# EAGLE design Sunflower (EAGLE 7.7.0)
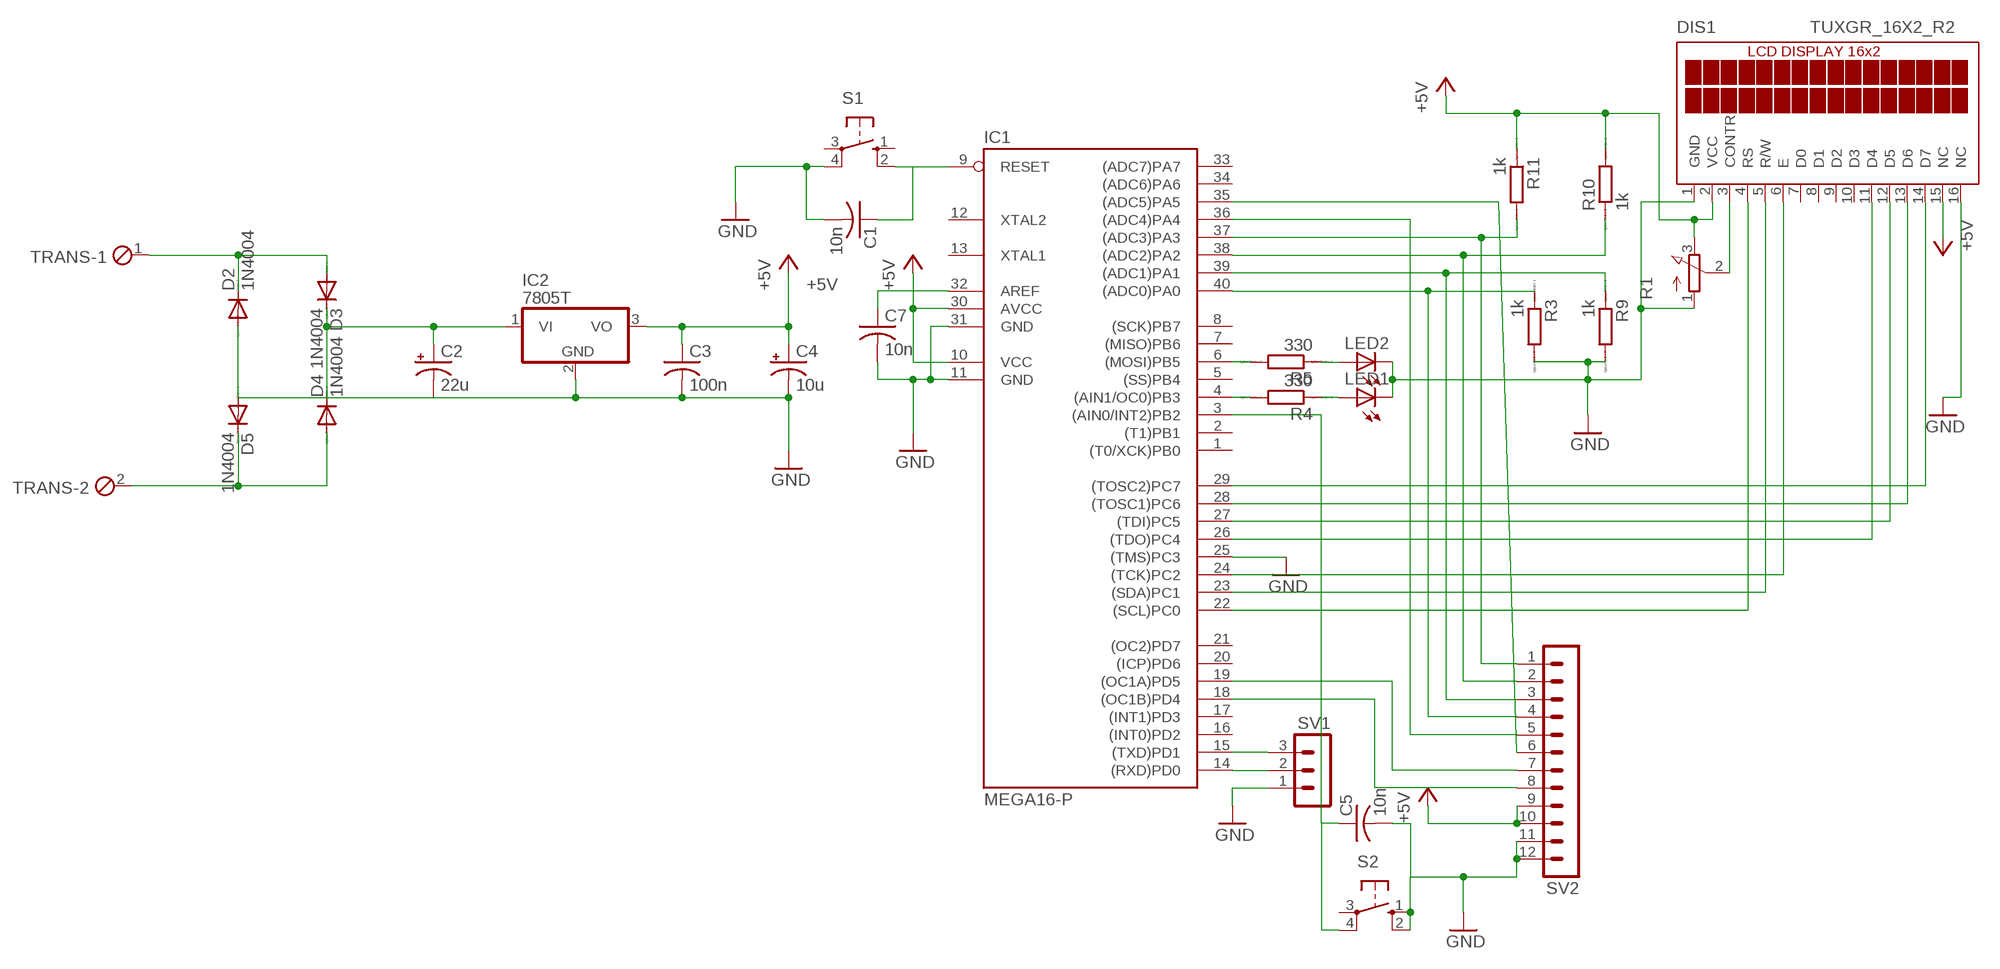
[diagram p0: schematic, sheet 1]

## Parts
C1  10n  C-US025-024X044  [C025-024X044]
C2  22u  CPOL-USE2.5-6  [E2,5-6]
C3  100n  C-US025-024X044  [C025-024X044]
C4  10u  CPOL-USE2.5-6  [E2,5-6]
C5  10n  C-US025-024X044  [C025-024X044]
C7  10n  C-US050-024X044  [C050-024X044]
D2  1N4004  [DO41-10]
D3  1N4004  [DO41-10]
D4  1N4004  [DO41-10]
D5  1N4004  [DO41-10]
DIS1  TUXGR_16X2_R2  [TUXGR_16X2_R2]
IC1  MEGA16-P  [DIL40]
IC2  7805T  [TO220H]
LED1  LED3MM  [LED3MM]
LED2  LED3MM  [LED3MM]
R1  3RP/1610N  [3RP/1610N]
R3  1k  R0207/10  [0207/10]
R4  330  R0207/10  [0207/10]
R5  330  R0207/10  [0207/10]
R9  1k  R0207/10  [0207/10]
R10  1k  R0207/10  [0207/10]
R11  1k  R0207/10  [0207/10]
S1  10-XX  [B3F-10XX]
S2  10-XX  [B3F-10XX]
SV1  MA03-1  [MA03-1]
SV2  MA12-1  [MA12-1]
TRANS  MPT2  [2POL254]

## Nets
+5V: C3.1 C4.+ DIS1.2(VCC) DIS1.15(NC) IC1.10(VCC) IC1.30(AVCC) IC2.3(VO) R1.3(E) R10.2 R11.1 SV2.9 SV2.10
GND: C1.2 C2.- C3.2 C4.- C5.2 C7.2 D2.A D5.A DIS1.1(GND) DIS1.16(NC) IC1.11(GND) IC1.25((TMS)PC3) IC1.31(GND) IC2.2(GND) LED1.K(C) LED2.K(C) R1.1(A) R3.2 R9.2 S1.4(P1) S2.1(S) S2.2(S1) SV1.1 SV2.11 SV2.12
N$1: D2.C D3.A TRANS.1
N$2: IC1.6((MOSI)PB5) R5.2
N$3: IC1.4((AIN1/OC0)PB3) R4.2
N$4: C2.+ D3.C D4.C IC2.1(VI)
N$5: C7.1 IC1.32(AREF)
N$6: LED2.A R5.1
N$7: DIS1.4(RS) IC1.22((SCL)PC0)
N$8: DIS1.5(R/W) IC1.23((SDA)PC1)
N$9: DIS1.6(E) IC1.24((TCK)PC2)
N$10: DIS1.14(D7) IC1.29((TOSC2)PC7)
N$11: DIS1.13(D6) IC1.28((TOSC1)PC6)
N$12: DIS1.12(D5) IC1.27((TDI)PC5)
N$13: DIS1.11(D4) IC1.26((TDO)PC4)
N$14: C5.1 IC1.3((AIN0/INT2)PB2) S2.4(P1)
N$15: IC1.40((ADC0)PA0) R3.1 SV2.4
N$16: IC1.18((OC1B)PD4) SV2.8
N$17: IC1.19((OC1A)PD5) SV2.7
N$18: DIS1.3(CONTR) R1.2(S)
N$19: IC1.37((ADC3)PA3) R11.2 SV2.1
N$20: IC1.39((ADC1)PA1) R9.1 SV2.3
N$21: IC1.38((ADC2)PA2) R10.1 SV2.2
N$22: LED1.A R4.1
N$23: IC1.36((ADC4)PA4) SV2.5
N$24: C1.1 IC1.9(RESET) S1.2(S1)
N$25: IC1.35((ADC5)PA5) SV2.6
N$26: IC1.15((TXD)PD1) SV1.3
N$27: IC1.14((RXD)PD0) SV1.2
O: D4.A D5.C TRANS.2
Unconnected: DIS1.7(D0) DIS1.8(D1) DIS1.9(D2) DIS1.10(D3) IC1.1((T0/XCK)PB0) IC1.2((T1)PB1) IC1.5((SS)PB4) IC1.7((MISO)PB6) IC1.8((SCK)PB7) IC1.12(XTAL2) IC1.13(XTAL1) IC1.16((INT0)PD2) IC1.17((INT1)PD3) IC1.20((ICP)PD6) IC1.21((OC2)PD7) IC1.33((ADC7)PA7) IC1.34((ADC6)PA6) S1.1(S) S1.3(P) S2.3(P)

## Library data of the parts
C1 C3 C5 C7 = rcl:C-US: CAPACITOR, American symbol
C2 C4 = rcl:CPOL-US: POLARIZED CAPACITOR, American symbol
D2-D5 = diode:1N4004: DIODE general purpose rectifier, 1 A
DIS1 = display-lcd:TUXGR_16X2_R2: Tuxgraphics LCD display 16x2 characters reflective, without background light Source: tuxgr_12x2_r2.pdf; OC_FARNELL: unknown; OC_NEWARK: unknown
IC1 = atmel:MEGA16-P: MICROCONTROLLER 16 Kbytes FLASH 1 kbytes SRAM 512 bytes EEPROM USART 8-channel 10 bit ADC Source: avr.lbr; MPN: ATMEGA16-16PU; OC_FARNELL: 9171142; OC_NEWARK: 01M6885
IC2 = linear:78*: Positive VOLTAGE REGULATOR Source: http://cache.national.com/ds/LM/LM78L05.pdf http://www.fairchildsemi.com/ds/LM/LM7805.pdf
LED1 LED2 = led:LED: LED OSRAM: - CHIPLED LG R971, LG N971, LY N971, LG Q971, LY Q971, LO R971, LY R971 LH N974, LH R974 LS Q976, LO Q976, LY Q976 LO Q996 - Hyper CHIPLED LW Q18S LB Q993, LB Q99A, LB R99A - SideLED LS A670, LO A670, LY A670, LG A670, LP A670 LB A673, LV A673, LT A673, LW A673 LH A674 LY A675 LS A676, LA A676, LO A676, LY A676, LW A676 LS A679, LY A679, LG A679 - Hyper Micro SIDELED® LS Y876, LA Y876, LO Y876, LY Y876 LT Y87S - SmartLED LW L88C, LW L88S LB L89C, LB L89S, LG L890 LS L89K, LO L89K, LY L89K LS L896, LA L896, LO L896, LY L896 - TOPLED LS T670, LO T670, LY T670, LG T670, LP T670 LSG T670, LSP T670, LSY T670, LOP T670, LYG T670 LG T671, LOG T671, LSG T671 LB T673, LV T673, LT T673, LW T673 LH T674 LS T676, LA T676, LO T676, LY T676, LB T676, LH T676, LSB T676, LW T676 LB T67C, LV T67C, LT T67C, LS T67K, LO T67K, LY T67K, LW E67C LS E67B, LA E67B, LO E67B, LY E67B, LB E67C, LV E67C, LT E67C LW T67C LS T679, LY T679, LG T679 LS T770, LO T770, LY T770, LG T770, LP T770 LB T773, LV T773, LT T773, LW T773 LH T774 LS E675, LA E675, LY E675, LS T675 LS T776, LA T776, LO T776, LY T776, LB T776 LHGB T686 LT T68C, LB T68C - Hyper Mini TOPLED® LB M676 - Mini TOPLED Santana® LG M470 LS M47K, LO M47K, LY M47K Source: http://www.osram.convergy.de LUXEON: - LUMILED® LXK2-PW12-R00, LXK2-PW12-S00, LXK2-PW14-U00, LXK2-PW14-V00 LXK2-PM12-R00, LXK2-PM12-S00, LXK2-PM14-U00 LXK2-PE12-Q00, LXK2-PE12-R00, LXK2-PE12-S00, LXK2-PE14-T00, LXK2-PE14-U00 LXK2-PB12-K00, LXK2-PB12-L00, LXK2-PB12-M00, LXK2-PB14-N00, LXK2-PB14-P00, LXK2-PB14-Q00 LXK2-PR12-L00, LXK2-PR12-M00, LXK2-PR14-Q00, LXK2-PR14-R00 LXK2-PD12-Q00, LXK2-PD12-R00, LXK2-PD12-S00 LXK2-PH12-R00, LXK2-PH12-S00 LXK2-PL12-P00, LXK2-PL12-Q00, LXK2-PL12-R00 Source: www.luxeon.com KINGBRIGHT: KA-3528ASYC Source: www.kingbright.com
R1 = pot:3RP/1610N: 16mm Potentiometer one level Source: http://www.alphapotentiometers.net/html/16mm_pot_2.html
R3-R5 R9-R11 = eagle-ltspice:R: RESISTOR, European symbol; SPICEMODEL: NONE; SPICEPREFIX: R
S1 S2 = switch-omron:10-XX: OMRON SWITCH; MPN: B3F-1000; OC_FARNELL: 176432; OC_NEWARK: 36M3542
SV1 = con-lstb:MA03-1: PIN HEADER; OC_FARNELL: unknown; OC_NEWARK: unknown
SV2 = con-lstb:MA12-1: PIN HEADER; OC_FARNELL: unknown; OC_NEWARK: unknown
TRANS = con-phoenix-254:MPT2: PHOENIX CONNECTOR; OC_FARNELL: unknown; OC_NEWARK: unknown

## Board
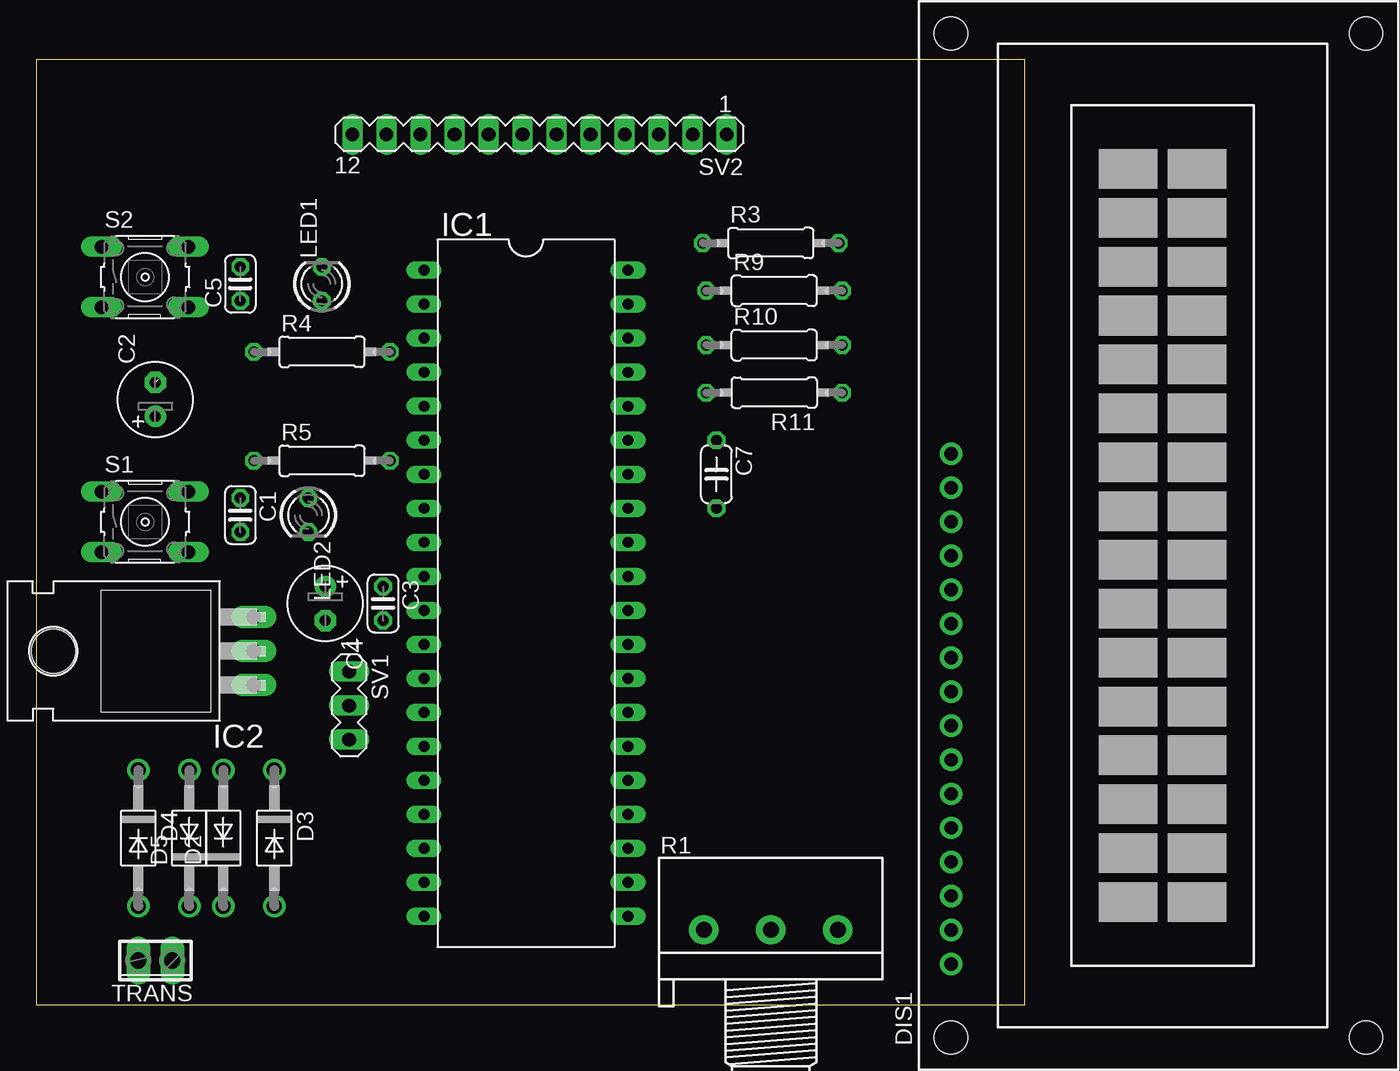
[diagram p1: board, top side]
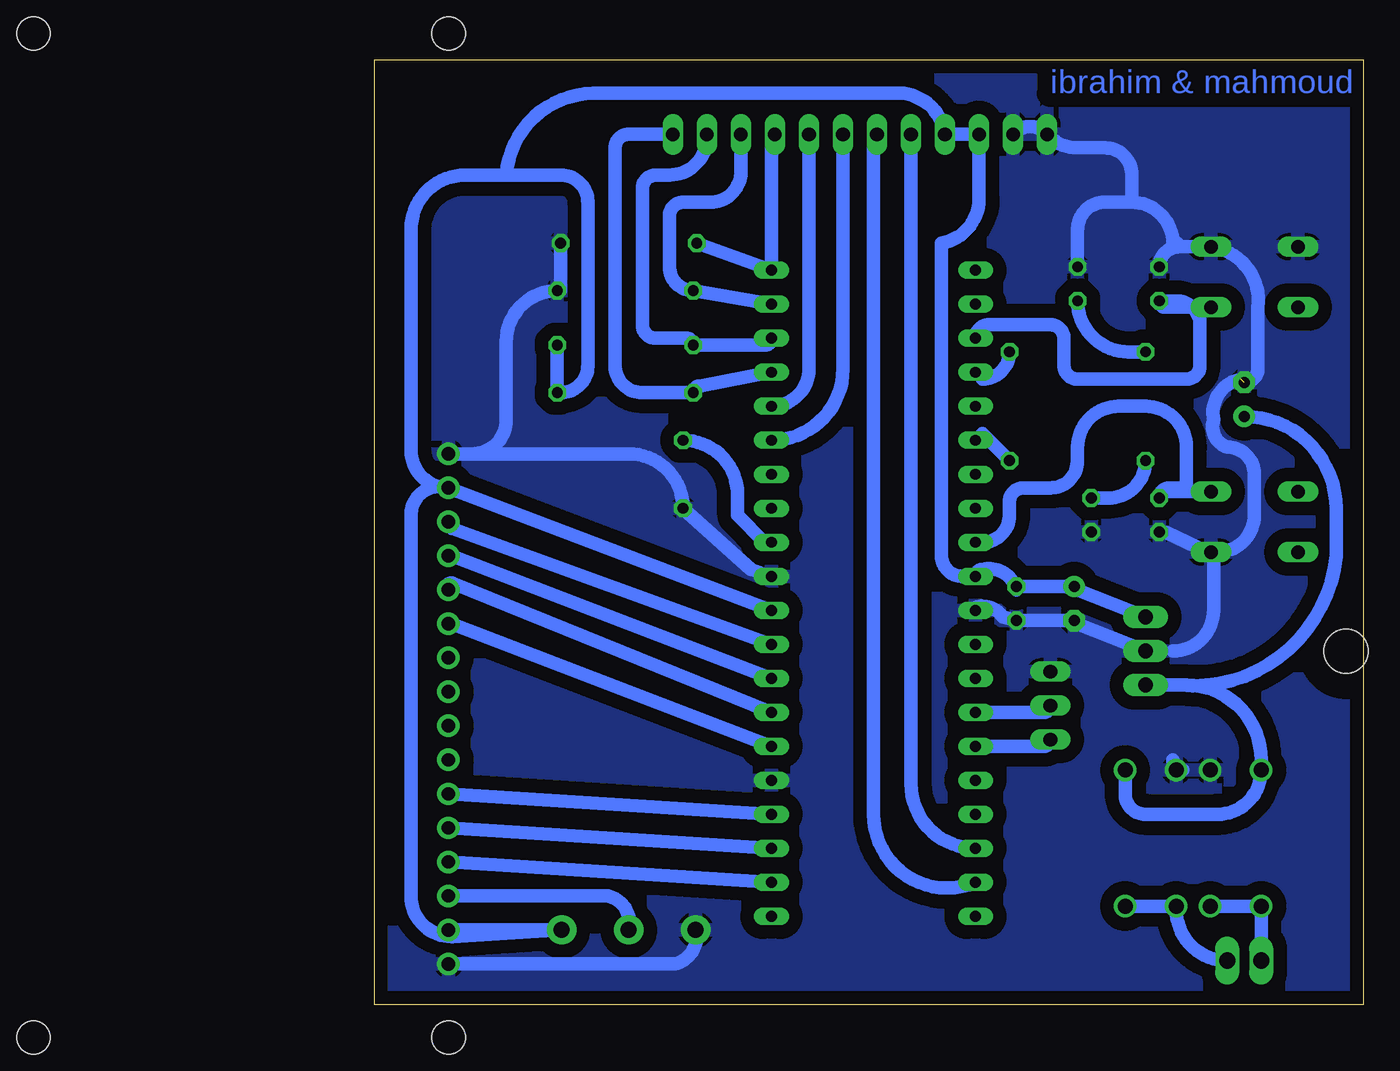
[diagram p2: board, bottom side, seen from below]

Size 73.84 x 70.6 mm. Coordinates in mm from the lower left corner, seen from the top.
Outline: 0,0 73.84,0 73.84,70.6 0,70.6 0,0
Copper layers (1*16): Top 0.035mm / dielectric 1.5mm / Bottom 0.035mm
Design rules "default": minimum track width 10mil, minimum drill 24mil, track to track 8mil, track to pad 8mil, pad to pad 8mil, via to via 8mil, smd to smd 8mil, copper to edge 40mil, drill to drill 8mil, minimum pad ring 10mil, minimum via ring 8mil, stop-mask expansion 4mil, vias tented up to drill 0mil, thermal gap 10mil

### Footprints (pad centres in the part's own frame; a part is rotated, then mirrored left to right if it is on the bottom)
C025-024X044 = drill 0.813 octagon: 1 -1.27,0; 2 1.27,0
E2,5-6 = drill 0.813 pad 1.6: + -1.27,0 | drill 0.813 pad 1.6 octagon: - 1.27,0
C050-024X044 = drill 0.813 octagon: 1 -2.54,0; 2 2.54,0
DO41-10 = drill 1.118: A 5.08,0; C -5.08,0
TUXGR_16X2_R2 = drill 1 pad 1.676: 1 -32,15.5; 2 -29.46,15.5; 3 -26.92,15.5; 4 -24.38,15.5; 5 -21.84,15.5; 6 -19.3,15.5; 7 -16.76,15.5; 8 -14.22,15.5; 9 -11.68,15.5; 10 -9.14,15.5; 11 -6.6,15.5; 12 -4.06,15.5; 13 -1.52,15.5; 14 1.02,15.5; 15 3.56,15.5; 16 6.1,15.5 | hole 2.5: -37.5,-15.5; 37.5,-15.5; -37.5,15.5; 37.5,15.5
DIL40 = drill 0.813 long: 1 -24.13,-7.62; 2 -21.59,-7.62; 3 -19.05,-7.62; 4 -16.51,-7.62; 5 -13.97,-7.62; 6 -11.43,-7.62; 7 -8.89,-7.62; 8 -6.35,-7.62; 9 -3.81,-7.62; 10 -1.27,-7.62; 11 1.27,-7.62; 12 3.81,-7.62; 13 6.35,-7.62; 14 8.89,-7.62; 15 11.43,-7.62; 16 13.97,-7.62; 17 16.51,-7.62; 18 19.05,-7.62; 19 21.59,-7.62; 20 24.13,-7.62; 21 24.13,7.62; 22 21.59,7.62; 23 19.05,7.62; 24 16.51,7.62; 25 13.97,7.62; 26 11.43,7.62; 27 8.89,7.62; 28 6.35,7.62; 29 3.81,7.62; 30 1.27,7.62; 31 -1.27,7.62; 32 -3.81,7.62; 33 -6.35,7.62; 34 -8.89,7.62; 35 -11.43,7.62; 36 -13.97,7.62; 37 -16.51,7.62; 38 -19.05,7.62; 39 -21.59,7.62; 40 -24.13,7.62
TO220H = drill 1.118 long: 1 -2.54,-10.16; 2 0,-10.16; 3 2.54,-10.16 | hole 3.302: 0,4.826
LED3MM = drill 0.813 octagon: A -1.27,0; K 1.27,0
3RP/1610N = drill 1.2 pad 2.184: 1 -5,0; 2 0,0; 3 5,0
0207/10 = drill 0.813 octagon: 1 -5.08,0; 2 5.08,0
B3F-10XX = drill 1.016 long: 1 -3.251,2.261; 2 3.251,2.261; 3 -3.251,-2.261; 4 3.251,-2.261
MA03-1 = drill 1.016 long: 1 -2.54,0; 2 0,0; 3 2.54,0
MA12-1 = drill 1.016 long: 1 -13.97,0; 2 -11.43,0; 3 -8.89,0; 4 -6.35,0; 5 -3.81,0; 6 -1.27,0; 7 1.27,0; 8 3.81,0; 9 6.35,0; 10 8.89,0; 11 11.43,0; 12 13.97,0
2POL254 = drill 1.2 long: 1 -1.27,0; 2 1.27,0

### Placement (x,y rotation side)
C1  15.24,36.58 270 top
C2  8.89,45.21 90 top
C3  25.91,29.97 270 top
C4  21.59,29.97 270 top
C5  15.24,53.85 90 top
C7  50.8,39.62 270 top
D2  13.97,12.45 90 top
D3  17.78,12.45 270 top
D4  7.62,12.45 270 top
D5  11.43,12.45 90 top
DIS1  83.82,35.05 90 top
IC1  36.58,30.73 270 top
IC2  6.1,26.42 90 top
LED1  21.34,53.85 90 top
LED2  20.32,36.58 270 top
R1  54.86,5.59 0 top
R3  54.86,56.9 0 top
R4  21.34,48.77 0 top
R5  21.34,40.64 0 top
R9  55.12,53.34 0 top
R10  55.12,49.28 0 top
R11  55.12,45.72 180 top
S1  8.13,36.07 0 top
S2  8.13,54.36 0 top
SV1  23.37,22.35 270 top
SV2  37.59,65.02 180 top
TRANS  8.89,3.3 180 top

### Tracks (layer width: path | path; a pad name or v marks a point on that pad's centre or on a via)
+5V
  Bottom 1.016: IC2.3 21.34,30.99 arc90 C4.+ C3.1 25.91,30.99 arc-90 28.45,32.51 arc-90 IC1.10 29.97,32 arc90 31.5,33.53 31.5,56.9 arc-80 28.7,60.2 SV2.10 SV2.9 arc-90 35.31,68.07 56.9,68.07 arc-90 64.01,61.98 | DIS1.2 R1.3 arc90 R1.3 68.07,5.08 arc90 71.12,8.13 71.12,36.58 arc108 DIS1.15 | DIS1.15 arc90 71.12,41.41 71.12,57.91 arc90 67.06,61.98 64.01,61.98 | 64.01,61.98 59.94,61.98 arc90 57.91,59.94 57.91,47.75 arc90 59.94,45.72 R11.1 R10.2 | IC1.30 DIS1.15
GND  (1 unrouted)
  Bottom 1.016: IC2.2 21.34,28.45 arc90 C4.- C3.2 26.92,28.96 arc-90 29.46,29.46 | S1.4 11.66,33.81 14.71,35.28 | S1.4 10.9,33.81 arc-90 8.13,36.58 8.13,39.62 arc-90 10.16,41.66 arc90 11.18,43.69 arc90 9.14,46.74 | 14.22,26.42 arc-90 11.18,29.46 11.18,33.6 arc-90 S1.4 | 13.74,56.62 S2.2 arc90 7.87,52.09 7.87,47.5 arc90 C2.- | 13.74,56.62 arc-90 C5.2 | SV2.11 arc96 SV2.12 arc-48 21.34,64.01 19.3,64.01 arc90 17.27,61.98 17.27,59.94 | R1.1 arc90 51.39,3.05 68.07,3.05 arc71 DIS1.1 | 13.46,17.53 arc90 14.22,18.29 | 17.27,59.94 arc90 14.22,56.9 14.02,56.9 arc90 13.74,56.62 | LED1.K 21.34,57.91 arc90 19.3,59.94 17.27,59.94 | R3.2 59.94,53.34 R9.2 arc-90 64.01,49.53 64.01,43.69 arc90 66.54,41.15 DIS1.16 54.87,41.15 arc90 C7.2 45.72,32.51 IC1.31
  pour Bottom (isolate 1.016): 0,71.12 1.02,1.02 73.15,0 73.15,71.12
N$1
  Bottom 1.016: D3.A D2.C 13.97,7.11 arc-90 TRANS.1
N$2
  Bottom 1.016: R5.2 28.45,42.67 arc90 IC1.6
N$3
  Bottom 1.016: R4.2 arc90 28.45,46.74 arc-90 IC1.4
N$4
  Bottom 1.016: D3.C 17.78,15.75 arc-90 16.26,14.22 10.92,14.22 arc-90 D4.C 7.62,18.29 arc-90 13.21,23.88 IC2.1 13.72,23.88 arc-90 2.03,33.53 2.03,37.08 arc-90 C2.+
N$5
  Bottom 1.016: IC1.32 44.7,34.54 46.74,36.58 46.74,38.1 arc-90 C7.1
N$6
  Bottom 1.016: R5.1 arc90 19.05,37.85 LED2.A
N$7
  Bottom 1.016: IC1.22 DIS1.4
N$8
  Bottom 1.016: DIS1.5 IC1.23
N$9
  Bottom 1.016: IC1.24 DIS1.6
N$10
  Bottom 1.016: DIS1.14 68.58,36.07 arc90 68.07,35.56 IC1.29
N$11
  Bottom 1.016: DIS1.13 68.08,33.53 arc90 68.07,33.53 IC1.28
N$12
  Bottom 1.016: DIS1.12 68.58,30.99 arc90 68.07,31.5 IC1.27
N$13
  Bottom 1.016: DIS1.11 68.08,28.45 arc90 68.07,28.45 IC1.26
N$14
  Bottom 1.016: S2.4 14.76,52.09 arc90 C5.1 13.97,52.58 arc90 12.19,50.8 12.19,47.75 arc90 13.21,46.74 21.34,46.74 arc90 22.35,47.75 22.35,49.78 arc-90 23.37,50.8 27.94,50.8 arc-90 IC1.3
N$15
  Bottom 1.016: SV2.4 arc-90 44.2,64.77 IC1.40 R3.1
N$16
  Bottom 1.016: SV2.8 33.78,16.51 arc-90 IC1.18
N$17
  Bottom 1.016: SV2.7 36.58,65.02 36.58,14.22 arc-113 IC1.19
N$18
  Bottom 1.016: R1.2 arc-90 56.39,8.13 DIS1.3
N$19
  Bottom 1.016: IC1.37 49.53,46.23 arc-90 R11.2 53.85,45.72 arc90 55.88,47.75 55.88,64.01 arc90 54.86,65.02 SV2.1
N$20
  Bottom 1.016: IC1.39 R9.1 arc90 51.82,55.12 51.82,58.93 arc90 50.8,59.94 48.77,59.94 arc-90 46.48,62.23 SV2.3
N$21
  Bottom 1.016: IC1.38 arc90 44.7,49.28 R10.1 arc-90 50.55,49.78 52.83,49.78 arc90 53.85,50.8 53.85,60.96 arc90 52.83,61.98 51.82,61.98 arc-90 49.02,64.77 SV2.2
N$22
  Bottom 1.016: LED1.A arc-90 17.53,48.77 R4.1
N$23
  Bottom 1.016: SV2.5 41.4,47.5 arc90 IC1.36
N$24
  Bottom 1.016: S1.2 14.76,38.33 C1.1 arc90 14.48,38.61 13.21,38.61 13.21,41.66 arc-90 16.26,44.7 18.29,44.7 arc-90 21.34,41.66 21.34,40.64 arc90 23.37,38.61 25.4,38.61 arc-90 26.42,37.59 26.42,36.58 arc90 28.45,34.54 IC1.9
N$25
  Bottom 1.016: SV2.6 38.86,47.5 arc90 IC1.35
N$26
  Bottom 1.016: SV1.3 arc90 23.88,19.3 IC1.15
N$27
  Bottom 1.016: SV1.2 arc90 23.88,21.84 IC1.14
O
  Bottom 1.016: D5.C D4.A TRANS.2

### Text on the board
Bottom: ibrahim & mahmoud